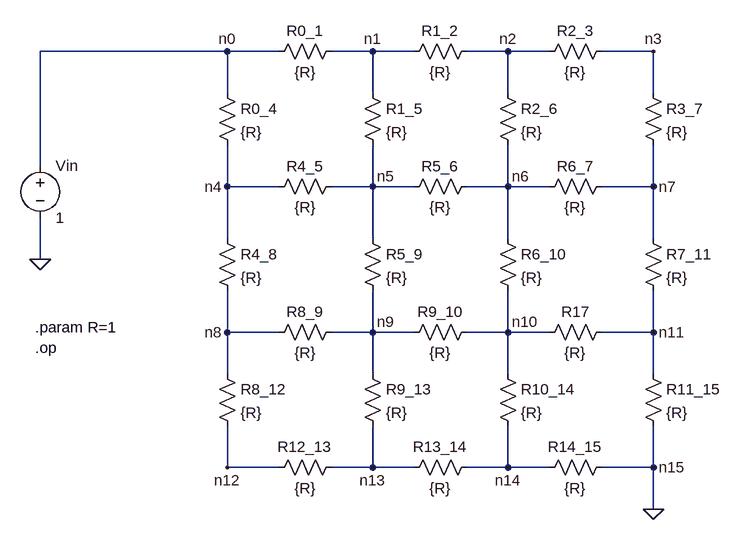
[diagram p0: schematic ResistorNetwork_2.asc]
ResistorNetwork_2.asc, the LTspice schematic file:
Version 4
SHEET 1 992 708
WIRE 224 -16 -64 -16
WIRE 304 -16 224 -16
WIRE 448 -16 384 -16
WIRE 512 -16 448 -16
WIRE 656 -16 592 -16
WIRE 720 -16 656 -16
WIRE 880 -16 800 -16
WIRE 224 48 224 -16
WIRE 448 48 448 -16
WIRE 656 48 656 -16
WIRE 880 48 880 -16
WIRE -64 160 -64 -16
WIRE 224 192 224 128
WIRE 304 192 224 192
WIRE 448 192 448 128
WIRE 448 192 384 192
WIRE 512 192 448 192
WIRE 656 192 656 128
WIRE 656 192 592 192
WIRE 720 192 656 192
WIRE 880 192 880 128
WIRE 880 192 800 192
WIRE 224 272 224 192
WIRE 448 272 448 192
WIRE 656 272 656 192
WIRE 880 272 880 192
WIRE -64 304 -64 240
WIRE 224 416 224 352
WIRE 304 416 224 416
WIRE 448 416 448 352
WIRE 448 416 384 416
WIRE 512 416 448 416
WIRE 656 416 656 352
WIRE 656 416 592 416
WIRE 720 416 656 416
WIRE 880 416 880 352
WIRE 880 416 800 416
WIRE 224 480 224 416
WIRE 448 480 448 416
WIRE 656 480 656 416
WIRE 880 480 880 416
WIRE 224 624 224 560
WIRE 304 624 224 624
WIRE 448 624 448 560
WIRE 448 624 384 624
WIRE 512 624 448 624
WIRE 656 624 656 560
WIRE 656 624 592 624
WIRE 720 624 656 624
WIRE 880 624 880 560
WIRE 880 624 800 624
WIRE 880 688 880 624
FLAG -64 304 0
FLAG 880 688 0
FLAG 224 -16 n0
FLAG 448 -16 n1
FLAG 656 -16 n2
FLAG 880 -16 n3
FLAG 224 192 n4
FLAG 448 192 n5
FLAG 656 192 n6
FLAG 880 192 n7
FLAG 224 416 n8
FLAG 448 416 n9
FLAG 656 416 n10
FLAG 880 416 n11
FLAG 224 624 n12
FLAG 448 624 n13
FLAG 656 624 n14
FLAG 880 624 n15
SYMBOL voltage -64 144 R0
WINDOW 123 0 0 Left 0
WINDOW 39 0 0 Left 0
SYMATTR InstName Vin
SYMATTR Value 1
SYMBOL res 400 -32 R90
WINDOW 0 0 56 VBottom 2
WINDOW 3 32 56 VTop 2
SYMATTR InstName R0_1
SYMATTR Value {R}
SYMBOL res 208 32 R0
SYMATTR InstName R0_4
SYMATTR Value {R}
SYMBOL res 496 0 R270
WINDOW 0 32 56 VTop 2
WINDOW 3 0 56 VBottom 2
SYMATTR InstName R1_2
SYMATTR Value {R}
SYMBOL res 432 32 R0
SYMATTR InstName R1_5
SYMATTR Value {R}
SYMBOL res 816 -32 R90
WINDOW 0 0 56 VBottom 2
WINDOW 3 32 56 VTop 2
SYMATTR InstName R2_3
SYMATTR Value {R}
SYMBOL res 640 32 R0
SYMATTR InstName R2_6
SYMATTR Value {R}
SYMBOL res 400 176 R90
WINDOW 0 0 56 VBottom 2
WINDOW 3 32 56 VTop 2
SYMATTR InstName R4_5
SYMATTR Value {R}
SYMBOL res 864 32 R0
SYMATTR InstName R3_7
SYMATTR Value {R}
SYMBOL res 608 176 R90
WINDOW 0 0 56 VBottom 2
WINDOW 3 32 56 VTop 2
SYMATTR InstName R5_6
SYMATTR Value {R}
SYMBOL res 208 256 R0
SYMATTR InstName R4_8
SYMATTR Value {R}
SYMBOL res 816 176 R90
WINDOW 0 0 56 VBottom 2
WINDOW 3 32 56 VTop 2
SYMATTR InstName R6_7
SYMATTR Value {R}
SYMBOL res 432 256 R0
SYMATTR InstName R5_9
SYMATTR Value {R}
SYMBOL res 400 400 R90
WINDOW 0 0 56 VBottom 2
WINDOW 3 32 56 VTop 2
SYMATTR InstName R8_9
SYMATTR Value {R}
SYMBOL res 640 256 R0
SYMATTR InstName R6_10
SYMATTR Value {R}
SYMBOL res 608 400 R90
WINDOW 0 0 56 VBottom 2
WINDOW 3 32 56 VTop 2
SYMATTR InstName R9_10
SYMATTR Value {R}
SYMBOL res 864 256 R0
SYMATTR InstName R7_11
SYMATTR Value {R}
SYMBOL res 816 400 R90
WINDOW 0 0 56 VBottom 2
WINDOW 3 32 56 VTop 2
SYMATTR InstName R17
SYMATTR Value {R}
SYMBOL res 208 464 R0
SYMATTR InstName R8_12
SYMATTR Value {R}
SYMBOL res 432 464 R0
SYMATTR InstName R9_13
SYMATTR Value {R}
SYMBOL res 400 608 R90
WINDOW 0 0 56 VBottom 2
WINDOW 3 32 56 VTop 2
SYMATTR InstName R12_13
SYMATTR Value {R}
SYMBOL res 640 464 R0
SYMATTR InstName R10_14
SYMATTR Value {R}
SYMBOL res 608 608 R90
WINDOW 0 0 56 VBottom 2
WINDOW 3 32 56 VTop 2
SYMATTR InstName R13_14
SYMATTR Value {R}
SYMBOL res 864 464 R0
SYMATTR InstName R11_15
SYMATTR Value {R}
SYMBOL res 816 608 R90
WINDOW 0 0 56 VBottom 2
WINDOW 3 32 56 VTop 2
SYMATTR InstName R14_15
SYMATTR Value {R}
TEXT -72 408 Left 2 !.param R=1
TEXT -72 440 Left 2 !.op

The netlist it stands for:
* ResistorNetwork_2.asc
Vin n0 0 1
R0_1 n1 n0 {R}
R0_4 n0 n4 {R}
R1_2 n1 n2 {R}
R1_5 n1 n5 {R}
R2_3 n3 n2 {R}
R2_6 n2 n6 {R}
R4_5 n5 n4 {R}
R3_7 n3 n7 {R}
R5_6 n6 n5 {R}
R4_8 n4 n8 {R}
R6_7 n7 n6 {R}
R5_9 n5 n9 {R}
R8_9 n9 n8 {R}
R6_10 n6 n10 {R}
R9_10 n10 n9 {R}
R7_11 n7 n11 {R}
R17 n11 n10 {R}
R8_12 n8 n12 {R}
R9_13 n9 n13 {R}
R12_13 n13 n12 {R}
R10_14 n10 n14 {R}
R13_14 n14 n13 {R}
R11_15 n11 0 {R}
R14_15 0 n14 {R}
.param R=1
.op
.backanno
.end